# Altium project USB to UART.PrjPcb
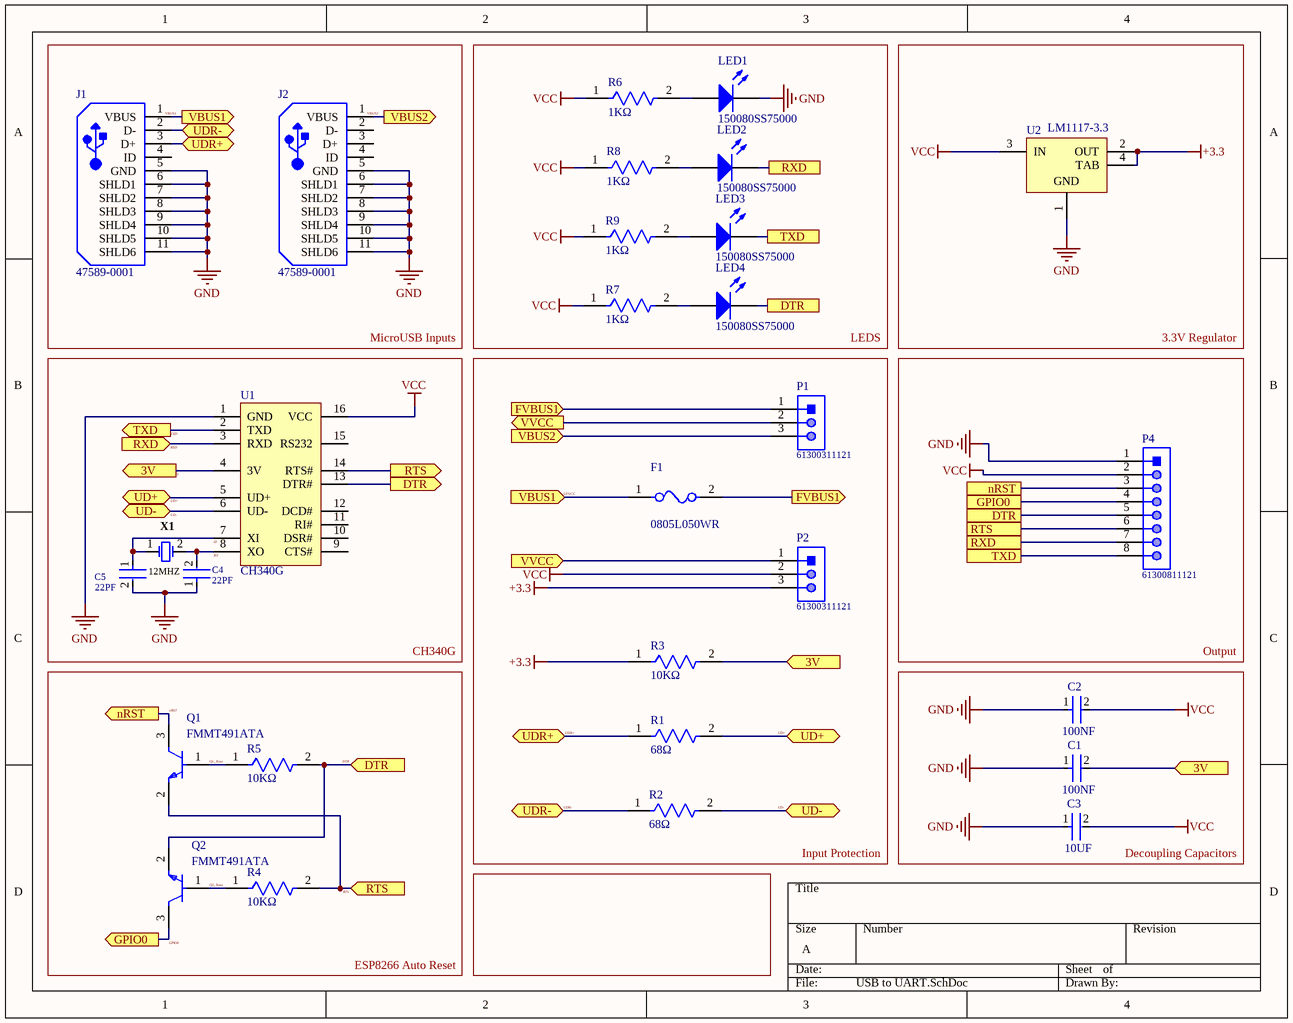
[diagram p0: USB to UART.SchDoc]
1 sheet, 29 parts. Net scope: flat (ports and power ports of the same name join across sheets).
Board file: USB to UART.PcbDoc

## Sheet USB to UART.SchDoc
size A

### Parts
C1  100NF  [FP-C0805C-DN-MFG]
C2  100NF  [FP-C0805C-DN-MFG]
C3  10UF  [FP-C0805C-DN-MFG]
C4  22PF  [FP-C0805C-DN-MFG]
C5  22PF  [FP-C0805C-DN-MFG]
F1  0805L050WR  [FP-0805L-MFG]
J1  47589-0001  [MOLX-47589-0001_V]
J2  47589-0001  [MOLX-47589-0001_V]
LED1  150080SS75000  [0805_A]
LED2  150080SS75000  [0805_A]
LED3  150080SS75000  [0805_A]
LED4  150080SS75000  [0805_A]
P1  61300311121  [61300311121]
P2  61300311121  [61300311121]
P4  61300811121  [61300811121]
Q1  FMMT491ATA  [FP-SOT23_Type_DN-MFG]
Q2  FMMT491ATA  [FP-SOT23_Type_DN-MFG]
R1  68Ω  [FP-CRCW0805-e3-IPC_C]
R2  68Ω  [FP-CRCW0805-e3-IPC_C]
R3  10KΩ  [FP-CRCW0805-e3-IPC_C]
R4  10KΩ  [FP-CRCW0805-e3-IPC_C]
R5  10KΩ  [FP-CRCW0805-e3-IPC_C]
R6  1KΩ  [FP-CRCW0805-e3-IPC_C]
R7  1KΩ  [FP-CRCW0805-e3-IPC_C]
R8  1KΩ  [FP-CRCW0805-e3-IPC_C]
R9  1KΩ  [FP-CRCW0805-e3-IPC_C]
U1  CH340G  [D0016A_L]
U2  LM1117-3.3  [DCY0004A_L]
X1  12MHZ  [FOX-FOXSLF-2_V]

### Blocks framed on the sheet
MicroUSB Inputs: J1 J2
LEDS: LED1-LED4 R6-R9
3.3V Regulator: U2
CH340G: C4 C5 U1 X1
Input Protection: F1 P1 P2 R1-R3
Output: P4
ESP8266 Auto Reset: Q1 Q2 R4 R5
Decoupling Capacitors: C1-C3

### Ports
3V (in), 3V (out), DTR, DTR (in), DTR (out), FVBUS1 (in), FVBUS1 (out), GPIO0, GPIO0 (out), nRST, nRST (out), RTS, RTS (in), RTS (out), RXD, RXD (in), TXD, TXD (out), UD+ (bidir), UD- (bidir), UDR+ (bidir), UDR- (bidir), VBUS1 (in), VBUS1 (out), VBUS2 (in), VBUS2 (out), VVCC (in), VVCC (out)

### Nets
+3.3: P2.3 R3.1 U2.2(OUT) U2.4(TAB)
GND: C1.1 C2.1 C3.1 C4.1 C5.2 J1.5(GND) J1.6(SHLD1) J1.7(SHLD2) J1.8(SHLD3) J1.9(SHLD4) J1.10(SHLD5) J1.11(SHLD6) J2.5(GND) J2.6(SHLD1) J2.7(SHLD2) J2.8(SHLD3) J2.9(SHLD4) J2.10(SHLD5) J2.11(SHLD6) LED1.1(K) P4.1 U1.1(GND) U2.1(GND)
VCC: C2.2 C3.2 P2.2 P4.2 R6.1 R7.1 R8.1 R9.1 U1.16(VCC) U2.3(IN)
3V: C1.2 R3.2 U1.4(3V) ; port 3V
DTR: LED4.1(K) P4.5 Q2.2(E) R5.2 U1.13(DTR#) ; port DTR
GPIO0: P4.4 Q2.3(C) ; port GPIO0
nRST: P4.3 Q1.3(C) ; port nRST
Q1_Base: Q1.1(B) R5.1
Q2_Base: Q2.1(B) R4.1
RTS: P4.6 Q1.2(E) R4.2 U1.14(RTS#) ; port RTS
RXD: LED2.1(K) P4.7 U1.3(RXD) ; port RXD
TXD: LED3.1(K) P4.8 U1.2(TXD) ; port TXD
UD+: R1.2 U1.5(UD+) ; port UD+
UD-: R2.2 U1.6(UD-) ; port UD-
UDR+: J1.3(D+) R1.1 ; port UDR+
UDR-: J1.2(D-) R2.1 ; port UDR-
VBUS1: F1.1 J1.1(VBUS) ; port VBUS1
VBUS2: J2.1(VBUS) P1.3 ; port VBUS2
XI: C5.1 U1.7(XI) X1.1
XO: C4.2 U1.8(XO) X1.2
NetF1_2: F1.2 P1.1 ; port FVBUS1
NetLED1_2: LED1.2(A) R6.2
NetLED2_2: LED2.2(A) R8.2
NetLED3_2: LED3.2(A) R9.2
NetLED4_2: LED4.2(A) R7.2
NetP1_2: P1.2 P2.1 ; port VVCC

Not connected (* = marked no-connect by the designer): J1 4(ID); J2 2(D-) 3(D+) 4(ID); U1 9(CTS#) 10(DSR#) 11(RI#) 12(DCD#) 15(RS232)

### Notes on the sheet
- Labels drawn without touching a wire or pin: UFVCC

### Library data of the parts
C1-C3 = CMP-2007-00048-2: Capacitor; Ceramic; Cap; 22.0pF; Tol 5%; SMT; Vol-Rtg 50V; C0G; Tape and Reel; Manufacturer: KEMET; Manufacturer Part Number: C0805C220J5GACTU; Temperature Coefficient: 30ppm/°C; Capacitance: 22 pF; Value: 22 pF; Tolerance: 0.05; Device Class L1: Passive Components; Mouser Description: Multilayer Ceramic Capacitors MLCC - SMD/SMT 50volts 22pF C0G 5%; Temperature Range Low: -55°C; Automotive: No; Voltage Rating: 50 V; Material: Ceramic; Category: Cap; Height: 0.88mm; Temperature Range High: +125°C; Digikey Description: Capacitor; Ceramic; Cap; 22.0pF; Tol 5%; SMT; Vol-Rtg 50V; C0G; Tape and Reel; Octopart: https://octopart.com/c0805c220j5gactu-kemet-145470; ComponentLink2Description: Datasheet; Device Class L2: Capacitors; Ipc Land Pattern Name: CAPC200125X78; RoHS: TRUE; ComponentLink2URL: https://content.kemet.com/datasheets/KEM_C1003_C0G_SMD.pdf; Temperature: -55°C to +125°C; Device Class L3: Ceramic Capacitors; Lead Free: Yes; Temperature Characteristic: C0G; Package: C0805C-DN
C4 C5 = CMP-2007-00048-2: Capacitor; Ceramic; Cap; 22.0pF; Tol 5%; SMT; Vol-Rtg 50V; C0G; Tape and Reel; Manufacturer: KEMET; Manufacturer Part Number: C0805C220J5GACTU; Temperature Coefficient: 30ppm/°C; Tolerance: 0.05; Device Class L1: Passive Components; Mouser Description: Multilayer Ceramic Capacitors MLCC - SMD/SMT 50volts 22pF C0G 5%; Temperature Range Low: -55°C; Automotive: No; Voltage Rating: 50 V; Material: Ceramic; Category: Cap; Height: 0.88mm; Temperature Range High: +125°C; Capacitance: 22 pF; Digikey Description: Capacitor; Ceramic; Cap; 22.0pF; Tol 5%; SMT; Vol-Rtg 50V; C0G; Tape and Reel; Octopart: https://octopart.com/c0805c220j5gactu-kemet-145470; ComponentLink2Description: Datasheet; Device Class L2: Capacitors; Ipc Land Pattern Name: CAPC200125X78; Value: 22 pF; RoHS: TRUE; ComponentLink2URL: https://content.kemet.com/datasheets/KEM_C1003_C0G_SMD.pdf; Temperature: -55°C to +125°C; Device Class L3: Ceramic Capacitors; Lead Free: Yes; Temperature Characteristic: C0G; Package: C0805C-DN
F1 = CMP-08606-000023-1: PTC RESET FUSE 6V 500MA 0805; Manufacturer: Littelfuse Inc.; Current Rating: 100A; Hold Current: 0.5A; Value: 0.15-0.85Ω; Trip Time: 0.1s; Trip Current: 1A; Device Class L2: PTC Resettable Fuses; Manufacturer Part Number: 0805L050WR; Digikey Description: PTC RESET FUSE 6V 500MA 0805; ComponentLink2URL: https://www.littelfuse.com/~/media/electronics/datasheets/resettable_ptcs/littelfuse_ptc_0805l_datasheet.pdf.pdf; Package: 0805L; RoHS: TRUE; Temperature Range Low: -40°C; Octopart: https://octopart.com/0805l050wr-littelfuse-673858; Resistance: 0.15-0.85Ω; ComponentLink2Description: Datasheet; Category: Fuse; Height: 1.25mm; Mouser Description: PTC Resettable Fuse 0.5A(hold) 1A(trip) 6VDC 100A 0.5W 0.1s 0.15Ohm SMD Solder Pad 0805 T/R; Ambient Temperature Range High: +85°C; Automotive: No; Device Class L3: unset; Lead Free: Yes; Temperature: -40°C to +85°C; Voltage Rating: 6V; Ambient Temperature Range Low: -40°C; Temperature Range High: +85°C; Device Class L1: Circuit Protection
J1 J2 = CMP-2000-05610-1: Right Angle Female Type AB Micro USB Connector, 30 V, 1.8 A, -30 to 85 degC, RoHS, Tape and Reel; Number of Ports: 1Port; Current Rating: 1.8A; Brand: Molex; Connector Type: MicroUSBTypeABreceptacle; Number of Contacts: 5Contact; Voltage Rating: 30VAC; Color: Black; Product: MicroUSBTypeABConnectors; Package URL: http://www.molex.com/pdm_docs/sd/475890001_sd.pdf; Contact Plating: Gold; Datasheet URL: http://www.molex.com/webdocs/datasheets/pdf/en-us/0475890001_IO_CONNECTORS.pdf; Operating Temperature Range: -20Cto+85C; Termination Style: SMD/SMT; Mounting Angle: Right; Package Reference: 47589-0001; Gender: Female; Package Description: Micro USB Connector, Pitch 0.65 mm, 5 Positions, Body 7.5 x 5.6 mm; Mounting Technology: SurfaceMount; Contact Material: CopperAlloy; Packaging: Reel; RoHS: True; Standard: USB; Manufacturer URL: http://www.molex.com/; Manufacturer: Molex; Datasheet Version: 12/2016; Product Category: USBConnectors; Series: 47589
LED1-LED4 = CMP-1426-00010-1: SMD mono-color Chip LED, WL-SMCW, Super Red; Manufacturer: Wuerth Elektronik; PackageReference: 0805_A; ComponentLink2URL: http://katalog.we-online.com/led/datasheet/150080SS75000.pdf; ComponentLink1URL: http://www.we-online.com; Color: Super Red; ComponentLink2Description: Datasheet; ComponentLink1Description: Manufacturer URL; PartNumber: 150080SS75000
P1 P2 = CMP-1502-01062-1: THT Vertical Pin Header WR-PHD, Pitch 2.54 mm, Single Row, 3 pins; Manufacturer: Wurth Elektronik; Withstanding Voltage: 500VAC; Working Voltage: 250VAC; Rated Current: 3A; Pitch: 2.54mm; Pin Number: 3; Gender: Male; Contact Resistance: 20mOhm; Package Reference: 61300311121; Manufacturer URL: http://www.we-online.de; Datasheet URL: https://katalog.we-online.de/em/datasheet/6130xx11121.pdf; Operating Temperature: -40to105degC; Part Number: 61300311121; Orientation: Vertical; Packaging: Bag; Row Number: Single; Mounting Technology: THT; Publisher: WurthElektronik
P4 = CMP-1502-01076-1: THT Vertical Pin Header WR-PHD, Pitch 2.54 mm, Single Row, 8 pins; Manufacturer: Wurth Elektronik; Rated Current: 3A; Pin Number: 8; Working Voltage: 250VAC; Gender: Male; Contact Resistance: 20mOhm; Pitch: 2.54mm; Withstanding Voltage: 500VAC; Publisher: WurthElektronik; Operating Temperature: -40to105degC; Orientation: Vertical; Row Number: Single; Part Number: 61300811121; Package Reference: 61300811121; Mounting Technology: THT; Packaging: Bag; Manufacturer URL: http://www.we-online.de; Datasheet URL: https://katalog.we-online.de/em/datasheet/6130xx11121.pdf
Q1 Q2 = CMP-12798-000029-1: TRANSISTOR NPN 40V 1A SOT23-3 - ANY NPN TRANSOSTOR LIKE S8050 2N2222...; Manufacturer: Diodes; Number Of Elements: 1; Hfe Min: 300; Automotive Grade: Grade 0; Gain Bandwidth Product: 150MHz; Hfe Max: 900; Hfe Testvce: 5V; Rthja Max: 250°C/W; Standoff Height: 0.01mm; Emitter Base Voltage: 7V; Hfe Testic: 500mA; Power Dissipation: 500mW; Collector Emitter Saturation Voltage: 0.5V; Max Junction Temp: +150°C; ComponentLink2Description: Datasheet; Collector Emitter Voltage: 40V; Manufacturer Part Number: FMMT491ATA; Mouser Description: Bipolar Transistors - BJT NPN Medium Power; Octopart: https://octopart.com/fmmt491ata-diodes+inc.-356338; Temperature Range Low: -55°C; Collector Base Voltage: 40V; Ipc Land Pattern Name: SOT95P242X100-3; Number Of Npn: 1; Package: SOT23 (Type DN); Device Class L3: BJTs; RoHS: TRUE; Digikey Description: TRANS NPN 40V 1A SOT23-3; Automotive: Yes; Device Class L2: Transistors; Temperature: -55°C to +150°C; Lead Free: Yes; Height: 1.12mm; Device Class L1: Discrete Semiconductors; Footprint Url: https://www.diodes.com/assets/Package-Files/SOT23-Type-DN.pdf; Collector Emitter Breakdown Voltage: 40V; Category: Trans; Max Collector Current: 1A; Temperature Range High: +150°C; ComponentLink2URL: https://www.diodes.com/assets/Datasheets/FMMT491A.pdf
R1 R2 = CMP-2001-04940-2: RES Thick Film, 68Ω, 1%, 0.125W, 100ppm/°C, 0805; Working Voltage: 150V; Resistance: 130kR; Max Power Dissipation: 125mW; Case/Package: 0805; Packaging: Tape and Reel; Max Operating Temperature: 155°C; Military Standard: Not; Min Operating Temperature: -55°C; Composition: Thick Film; Package Quantity: 10; Width: 1.25mm; Number of Pins: 2; Mount: Surface Mount; Lead Free: Lead Free; Termination: SMD/SMT; Weight: 0.000194oz; Features: Automotive AEC-Q200; Radiation Hardening: No; Case Code (Imperial): 0805; Depth: 1.25mm; Voltage Rating (DC): 150V; Length: 2mm; Number of Terminations: 2; Power Rating: 125mW; Case Code (Metric): 2012; Voltage Rating: 150V; Contact Plating: Tin; Temperature Coefficient: 100ppm/°C; Tolerance: 1%; Height: 0.45mm
R3 = CMP-2001-04940-2: RES Thick Film, 10KΩ, 1%, 0.125W, 100ppm/°C, 0805; Working Voltage: 150V; Resistance: 130kR; Max Power Dissipation: 125mW; Case/Package: 0805; Packaging: Tape and Reel; Max Operating Temperature: 155°C; Military Standard: Not; Min Operating Temperature: -55°C; Composition: Thick Film; Package Quantity: 10; Width: 1.25mm; Number of Pins: 2; Mount: Surface Mount; Lead Free: Lead Free; Termination: SMD/SMT; Weight: 0.000194oz; Features: Automotive AEC-Q200; Radiation Hardening: No; Case Code (Imperial): 0805; Depth: 1.25mm; Voltage Rating (DC): 150V; Length: 2mm; Number of Terminations: 2; Power Rating: 125mW; Case Code (Metric): 2012; Voltage Rating: 150V; Contact Plating: Tin; Temperature Coefficient: 100ppm/°C; Tolerance: 1%; Height: 0.45mm
R4 R5 = CMP-2001-04940-2: RES Thick Film, 10kΩ, 1%, 0.125W, 100ppm/°C, 0805; Working Voltage: 150V; Resistance: 130kR; Max Power Dissipation: 125mW; Case/Package: 0805; Packaging: Tape and Reel; Max Operating Temperature: 155°C; Military Standard: Not; Min Operating Temperature: -55°C; Composition: Thick Film; Package Quantity: 10; Width: 1.25mm; Number of Pins: 2; Mount: Surface Mount; Lead Free: Lead Free; Termination: SMD/SMT; Weight: 0.000194oz; Features: Automotive AEC-Q200; Radiation Hardening: No; Case Code (Imperial): 0805; Depth: 1.25mm; Voltage Rating (DC): 150V; Length: 2mm; Number of Terminations: 2; Power Rating: 125mW; Case Code (Metric): 2012; Voltage Rating: 150V; Contact Plating: Tin; Temperature Coefficient: 100ppm/°C; Tolerance: 1%; Height: 0.45mm
R6 = CMP-2001-04940-2: RES Thick Film, 1kΩ, 1%, 0.125W, 100ppm/°C, 0805; Working Voltage: 150V; Resistance: 130kR; Max Power Dissipation: 125mW; Case/Package: 0805; Packaging: Tape and Reel; Max Operating Temperature: 155°C; Military Standard: Not; Min Operating Temperature: -55°C; Composition: Thick Film; Package Quantity: 10; Width: 1.25mm; Number of Pins: 2; Mount: Surface Mount; Lead Free: Lead Free; Termination: SMD/SMT; Weight: 0.000194oz; Features: Automotive AEC-Q200; Radiation Hardening: No; Case Code (Imperial): 0805; Depth: 1.25mm; Voltage Rating (DC): 150V; Length: 2mm; Number of Terminations: 2; Power Rating: 125mW; Case Code (Metric): 2012; Voltage Rating: 150V; Contact Plating: Tin; Temperature Coefficient: 100ppm/°C; Tolerance: 1%; Height: 0.45mm
R7-R9 = CMP-2001-04940-2: RES Thick Film, 1KΩ, 1%, 0.125W, 100ppm/°C, 0805; Working Voltage: 150V; Resistance: 130kR; Max Power Dissipation: 125mW; Case/Package: 0805; Packaging: Tape and Reel; Max Operating Temperature: 155°C; Military Standard: Not; Min Operating Temperature: -55°C; Composition: Thick Film; Package Quantity: 10; Width: 1.25mm; Number of Pins: 2; Mount: Surface Mount; Lead Free: Lead Free; Termination: SMD/SMT; Weight: 0.000194oz; Features: Automotive AEC-Q200; Radiation Hardening: No; Case Code (Imperial): 0805; Depth: 1.25mm; Voltage Rating (DC): 150V; Length: 2mm; Number of Terminations: 2; Power Rating: 125mW; Case Code (Metric): 2012; Voltage Rating: 150V; Contact Plating: Tin; Temperature Coefficient: 100ppm/°C; Tolerance: 1%; Height: 0.45mm
U1 = CMP-1575-00035-4: High Speed CMOS 8-Channel Analog Multiplexer/Demultiplexer, D0016A, TUBE; Manufacturer: Texas Instruments; Generic Part Number: CD74HC4051; Bandwidth(Max)(MHz): 180; VCC(Max)(V): 6; Ron(Max)(Ohms): 130; VCC(Min)(V): 2; Rating: Catalog; Ron(Typ)(Ohms): 45; Configuration: 1 X 1：8 MUX; Crosstalk: Yes; Operating Temperature Range(C): -55 to 125; Output Type: CMOS; Code_JEDEC: MS-012 variation AC; PackageReference: D0016A; PackageVersion: http://www.ti.com/lit/ml/mpds178g/mpds178g.pdf; DatasheetVersion: SCHS122J
U2 = CMP-0062-01638-4: 800mA Low-Dropout Linear Regulator, 4-pin SOT-223, Pb-Free; PartNumber: LM1117MP-3.3/NOPB; Manufacturer: Texas Instruments; CompType: LDO IC; PackageTopMarking: XYTT*N05A; High-Reliability: Y; PowerWise: N; ComponentLink1URL: http://www.ti.com/general/docs/lit/getliterature.tsp?genericPartNumber=LM1117-N&fileType=pdf; PinCount: 4; PackageDescription: Molded SOT-223, 6.50 x 3.56 x 1.6mm Body, 4 Lead, 2.3mm Pitch; Code_IPC: SOT223-4; Code_JEDEC: TO-261-AA; RoHS: Y; PackageReference: DCY0004A; ComponentLink1Description: Datasheet URL
X1 = CMP-1749-00004-1: Resistance Weld Thru-Hole Crystal, 12 MHz, +/-30 ppm, -20 to 70 degC, 2-Pin THD, RoHS, Bulk; Elements: 1; Rds On Max: 115 mohm; Typical Rise Time: 90 ns; Max Power Dissipation: 2.5 W; Case\Package: TO-251-3; Input Capacitance: 350 pF; REACH SVHC: No SVHC; Length: 6.6 mm; ComponentLink1URL: http://www.foxonline.com/; PackageDescription: 2-Pin Through Hole Device, Body 11.35 x 4.65 mm, Pitch 4.88 mm; Radiation Hardening: No; Package Quantity: 70; Packaging: Rail/Tube; ComponentLink1Description: Manufacturer URL; Min Operating Temperature: -55 degC; Max Operating Temperature: 150 degC; RoHSCompliant: true; PackageReference: FOXSLF-2; DatasheetVersion: Mar-15; Pins: 3; Height: 6.1 mm; Mount: Through Hole; ComponentLink2URL: http://www.foxonline.com/pdfs/hc49slf.pdf; ComponentLink2Description: Datasheet; Width: 2.3 mm